# EAGLE schematic amyboard (EAGLE 6.1)
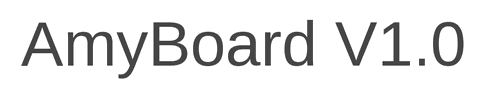
[diagram p0: schematic, sheet 1, part 1 of 3]
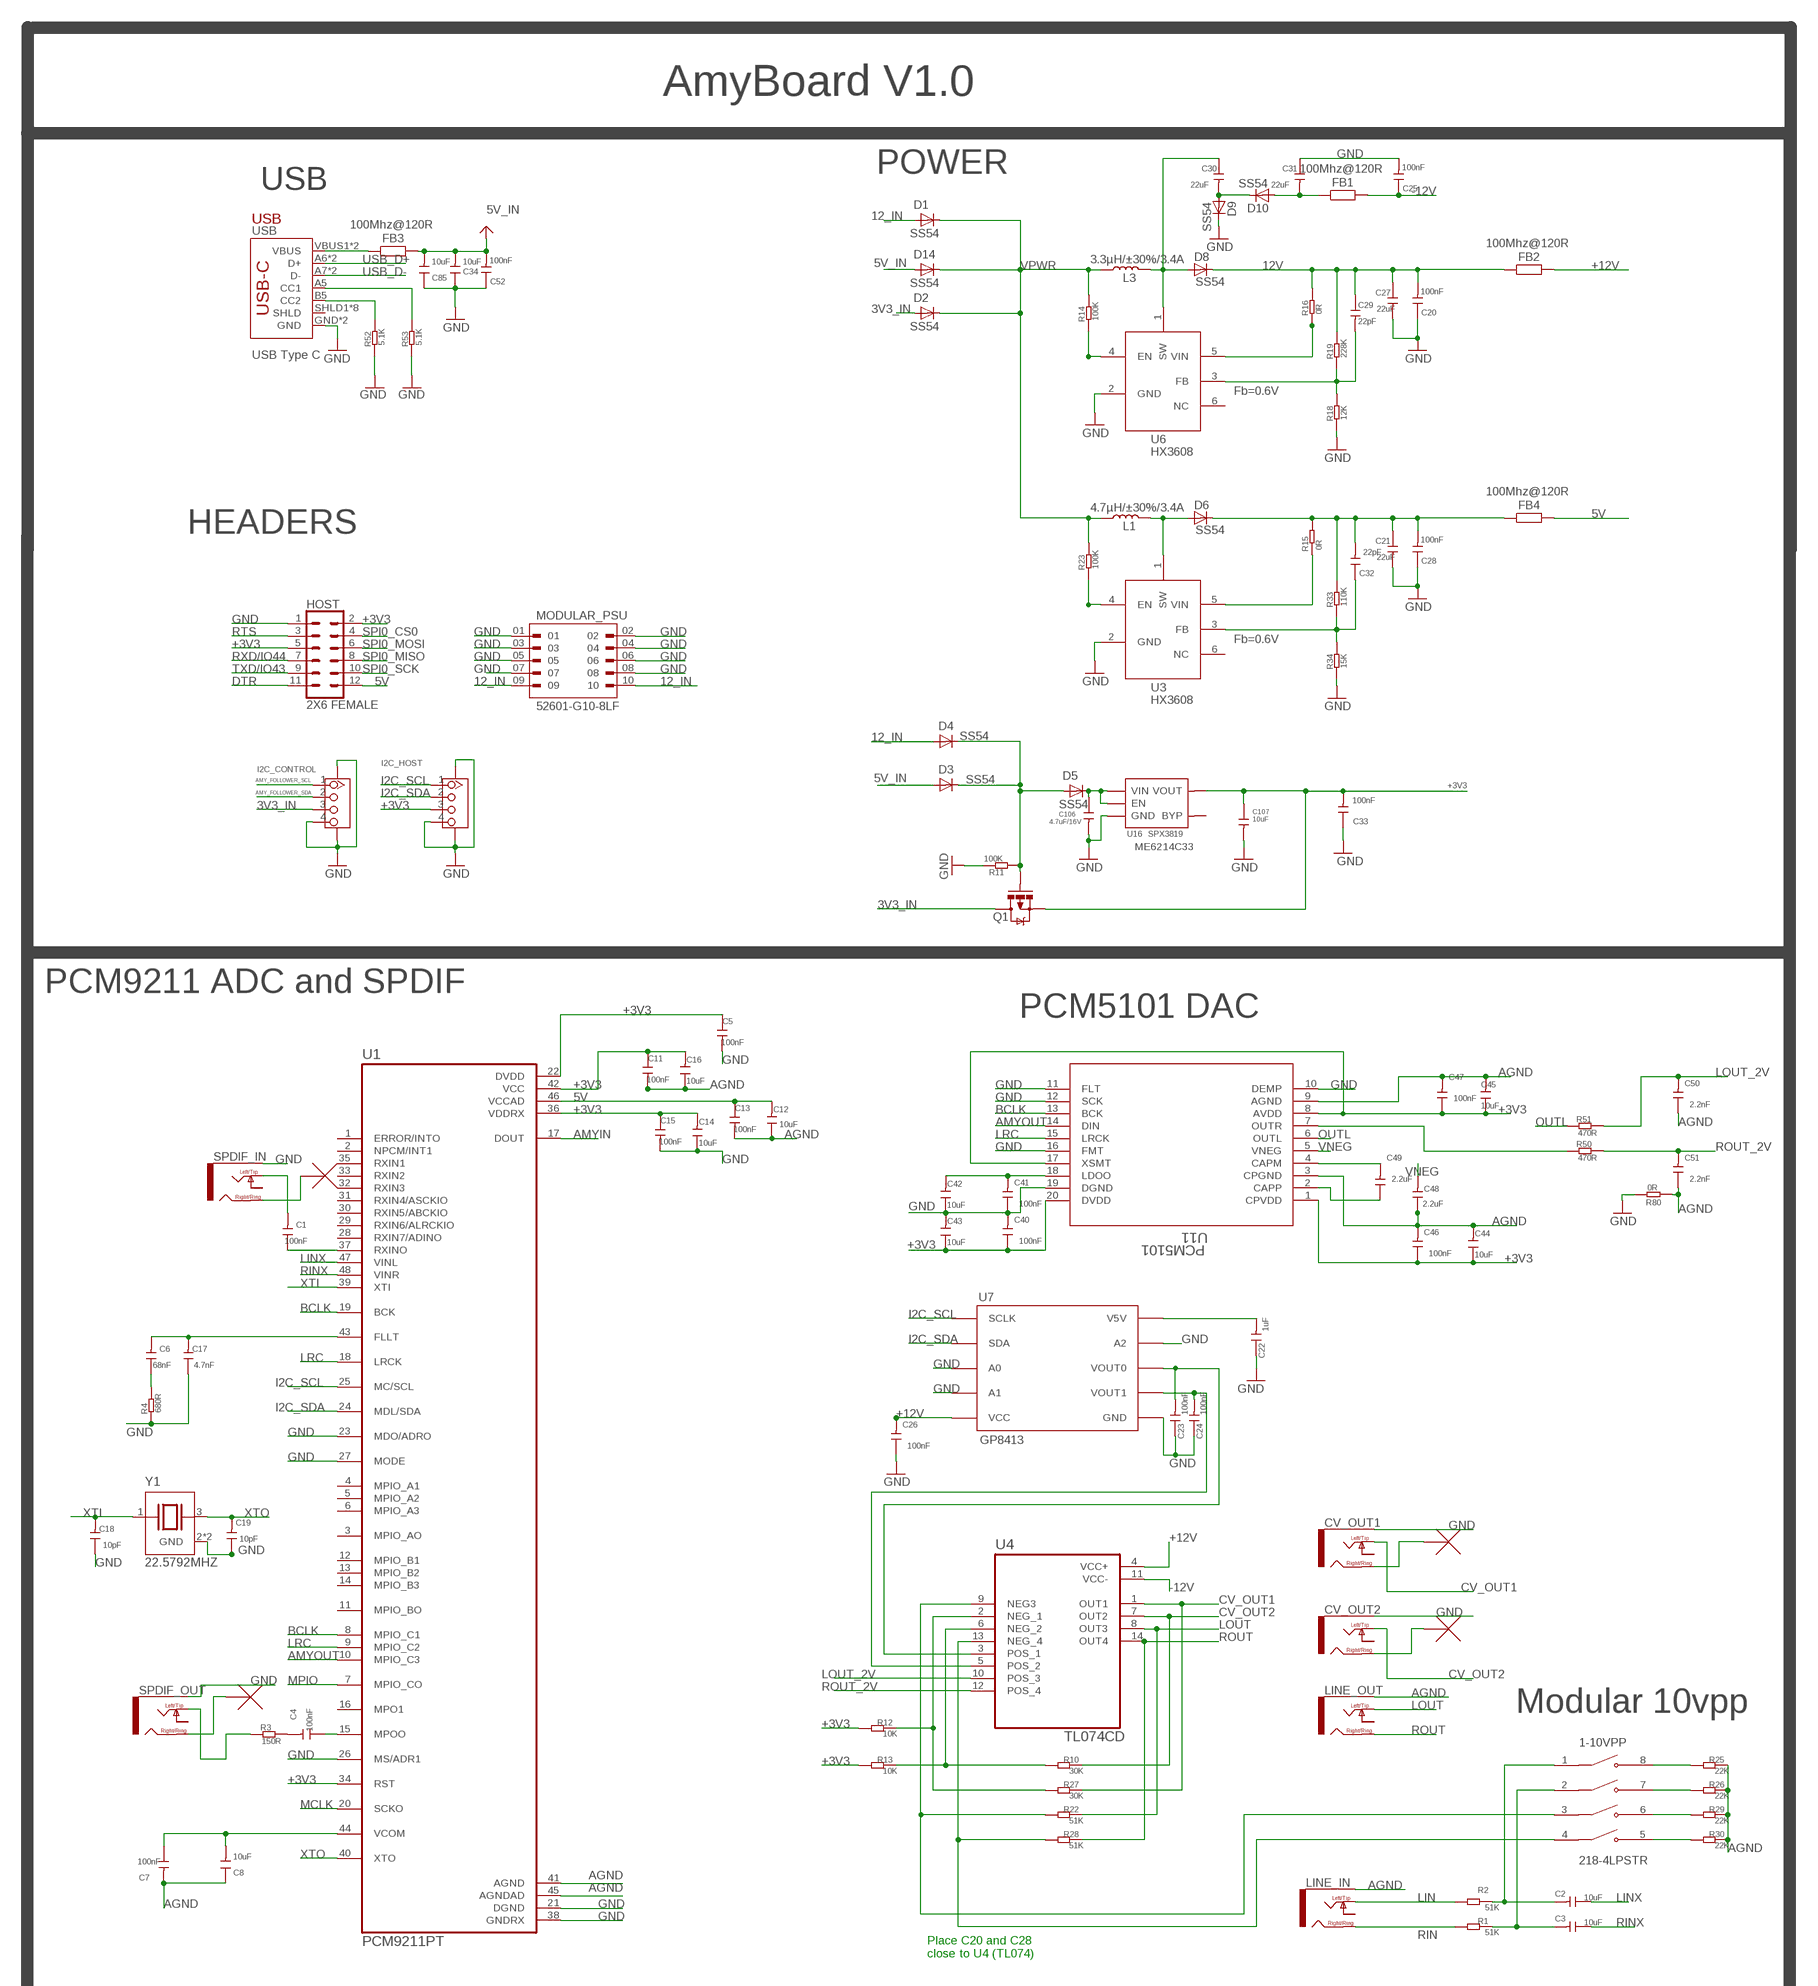
[diagram p1: schematic, sheet 1, part 2 of 3]
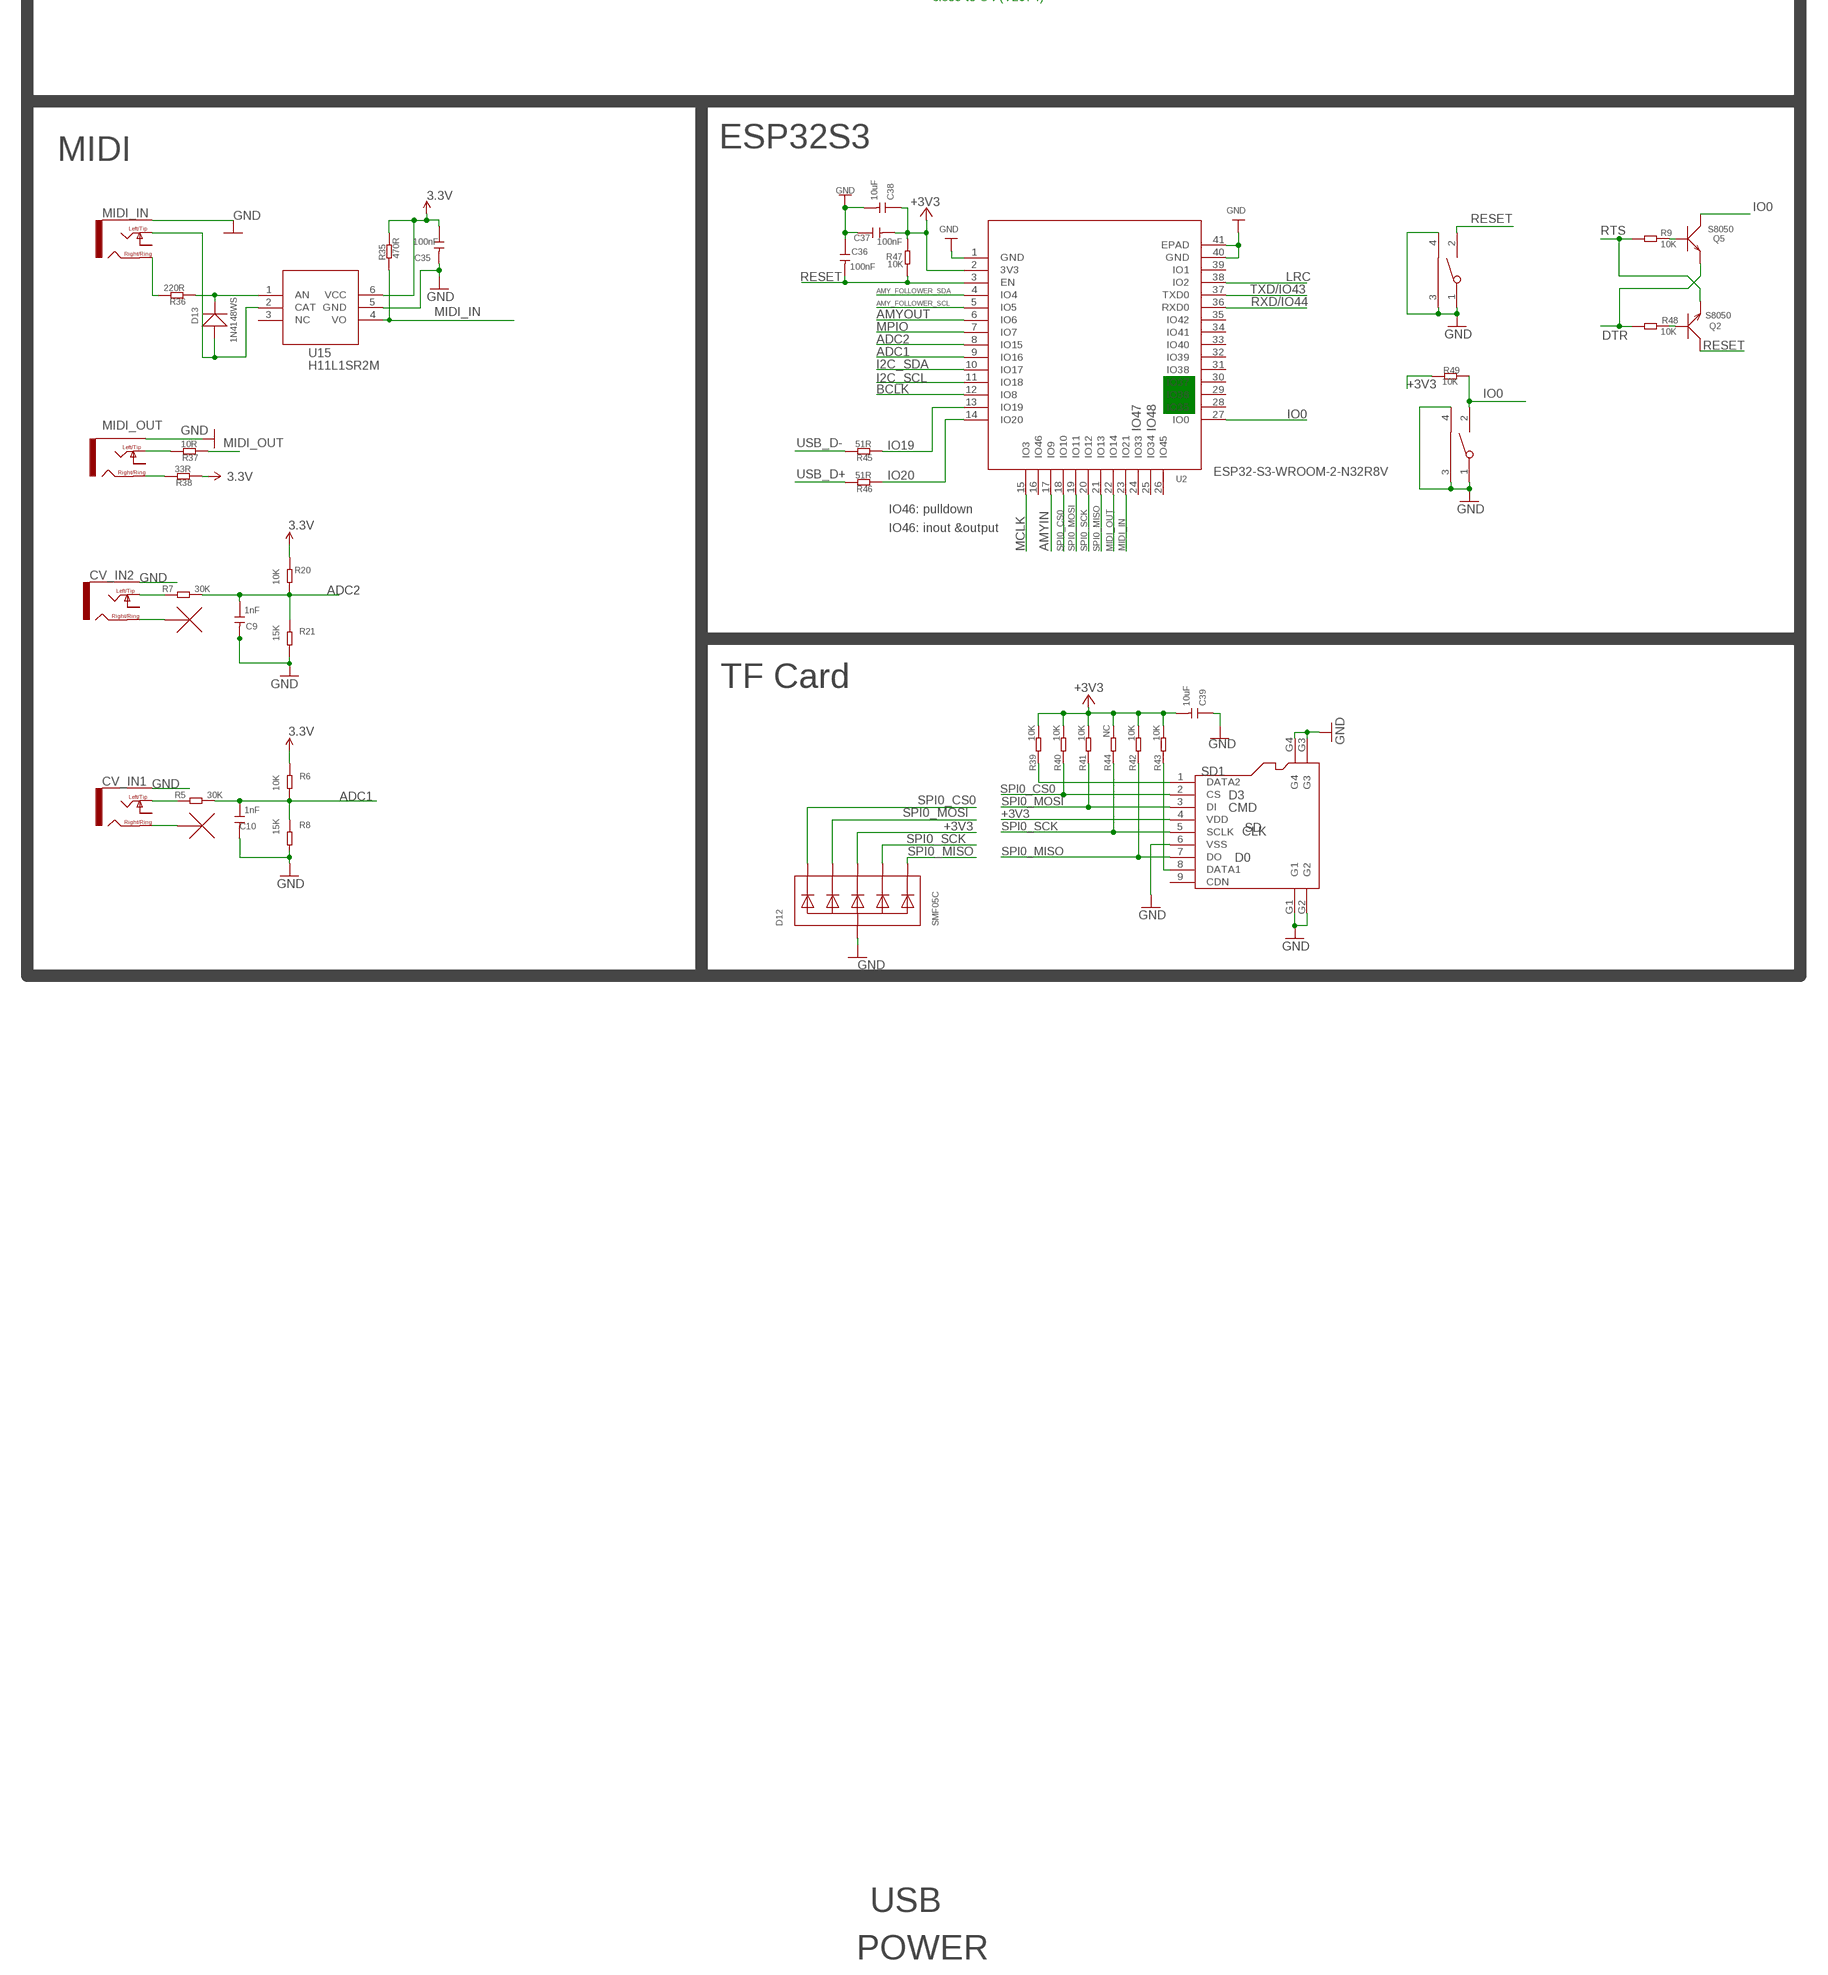
[diagram p2: schematic, sheet 1, part 3 of 3]

## Parts
1-10VPP  218-4LPSTR  [SW_218-4LPSTR]
BOOT  TS24CA  [2*4*3.5MM]
C1  100nF  DISCRETE_C-0402  [DISCRETE_C0402]
C2  10uF  DISCRETE_C-0603  [DISCRETE_C0603]
C3  10uF  DISCRETE_C-0603  [DISCRETE_C0603]
C4  100nF  DISCRETE_C-0402  [DISCRETE_C0402]
C5  100nF  DISCRETE_C-0402  [DISCRETE_C0402]
C6  68nF  DISCRETE_C-0402  [DISCRETE_C0402]
C7  100nF  DISCRETE_C-0402  [DISCRETE_C0402]
C8  10uF  DISCRETE_C-0603  [DISCRETE_C0603]
C9  1nF  DISCRETE_C-0402  [DISCRETE_C0402]
C10  1nF  DISCRETE_C-0402  [DISCRETE_C0402]
C11  100nF  DISCRETE_C-0402  [DISCRETE_C0402]
C12  10uF  DISCRETE_C-0603  [DISCRETE_C0603]
C13  100nF  DISCRETE_C-0402  [DISCRETE_C0402]
C14  10uF  DISCRETE_C-0603  [DISCRETE_C0603]
C15  100nF  DISCRETE_C-0402  [DISCRETE_C0402]
C16  10uF  DISCRETE_C-0603  [DISCRETE_C0603]
C17  4.7nF  DISCRETE_C-0402  [DISCRETE_C0402]
C18  10pF  DISCRETE_C-0402  [DISCRETE_C0402]
C19  10pF  DISCRETE_C-0402  [DISCRETE_C0402]
C20  100nF  DISCRETE_C-0402  [DISCRETE_C0402]
C21  22uF  CAP-0603  [C0603]
C22  1uF  DISCRETE_C-0402  [DISCRETE_C0402]
C23  100nF  DISCRETE_C-0402  [DISCRETE_C0402]
C24  100nF  DISCRETE_C-0402  [DISCRETE_C0402]
C25  100nF  DISCRETE_C-0402  [DISCRETE_C0402]
C26  100nF  DISCRETE_C-0402  [DISCRETE_C0402]
C27  22uF  CAP-0603  [C0603]
C28  100nF  DISCRETE_C-0402  [DISCRETE_C0402]
C29  22pF  CAP-0603  [C0603]
C30  22uF  CAP-0603  [C0603]
C31  22uF  CAP-0603  [C0603]
C32  22pF  DISCRETE_C-0402  [DISCRETE_C0402]
C33  100nF  DISCRETE_C-0402  [DISCRETE_C0402]
C34  10uF  DISCRETE_C-0603  [DISCRETE_C0603]
C35  100nF  DISCRETE_C-0402  [DISCRETE_C0402]
C36  100nF  DISCRETE_C-0402  [DISCRETE_C0402]
C37  100nF  DISCRETE_C-0402  [DISCRETE_C0402]
C38  10uF  DISCRETE_C-0603  [DISCRETE_C0603]
C39  10uF  DISCRETE_C-0603  [DISCRETE_C0603]
C40  100nF  DISCRETE_C-0402  [DISCRETE_C0402]
C41  100nF  DISCRETE_C-0402  [DISCRETE_C0402]
C42  10uF  DISCRETE_C-0603  [DISCRETE_C0603]
C43  10uF  DISCRETE_C-0603  [DISCRETE_C0603]
C44  10uF  DISCRETE_C-0603  [DISCRETE_C0603]
C45  10uF  DISCRETE_C-0603  [DISCRETE_C0603]
C46  100nF  DISCRETE_C-0402  [DISCRETE_C0402]
C47  100nF  DISCRETE_C-0402  [DISCRETE_C0402]
C48  2.2uF  DISCRETE_C-0402  [DISCRETE_C0402]
C49  2.2uF  DISCRETE_C-0402  [DISCRETE_C0402]
C50  2.2nF  DISCRETE_C-0402  [DISCRETE_C0402]
C51  2.2nF  DISCRETE_C-0402  [DISCRETE_C0402]
C52  100nF  DISCRETE_C-0402  [DISCRETE_C0402]
C85  10uF  DISCRETE_C-0603  [DISCRETE_C0603]
C106  4.7uF/16V  C-0603  [0603]
C107  10uF  C-0603  [0603]
CV_IN1  NV-PJ3410_STEREO  [NV-PJ3410_SOCKET]
CV_IN2  NV-PJ3410_STEREO  [NV-PJ3410_SOCKET]
CV_OUT1  NV-PJ3410_STEREO  [NV-PJ3410_SOCKET]
CV_OUT2  NV-PJ3410_STEREO  [NV-PJ3410_SOCKET]
D1  SS54  DIODE-DO-214AC  [DO-214AC]
D2  SS54  DIODE-DO-214AC  [DO-214AC]
D3  SS54  DIODE-DO-214AC  [DO-214AC]
D4  SS54  DIODE-DO-214AC  [DO-214AC]
D5  SS54  DIODE-DO-214AC  [DO-214AC]
D6  SS54  DIODE-DO-214AC  [DO-214AC]
D8  SS54  DIODE-DO-214AC  [DO-214AC]
D9  SS54  DIODE-DO-214AC  [DO-214AC]
D10  SS54  DIODE-DO-214AC  [DO-214AC]
D12  SMF05C  TVSARRAY_5LANE  [SOT363]
D13  1N4148WS  D'0805'  [SOD323]
D14  SS54  DIODE-DO-214AC  [DO-214AC]
FB1  100Mhz@120R  R-EU_R0805  [R0805]
FB2  100Mhz@120R  R-EU_R0805  [R0805]
FB3  100Mhz@120R  R-EU_R0805  [R0805]
FB4  100Mhz@120R  R-EU_R0805  [R0805]
HOST  2X6 FEMALE  CONN_06X2PTH_FEMALE  [2X6]
I2C_CONTROL  GROVE-CONNECTOR-SMD'90D'  [HW4-SMD-2.0-90D]
I2C_HOST  GROVE-CONNECTOR-SMD'90D'  [HW4-SMD-2.0-90D]
L1  4.7µH/±30%/3.4A  INDUCTOR-CR54-3.3UH  [CR54]
L3  3.3µH/±30%/3.4A  INDUCTOR-CR54-3.3UH  [CR54]
LINE_IN  NV-PJ3410_STEREO  [NV-PJ3410_SOCKET]
LINE_OUT  NV-PJ3410_STEREO  [NV-PJ3410_SOCKET]
MIDI_IN  NV-PJ3410_STEREO  [NV-PJ3410_SOCKET]
MIDI_OUT  NV-PJ3410_STEREO  [NV-PJ3410_SOCKET]
MODULAR_PSU  52601-G10-8LF  [AMPHENOL_52601-G10-8LF]
PCM5101  U11  PCM5101APW  [PW20_TEX]
Q1  AO3407  MOSFET-PCHANNEL  [SOT23-3]
Q2  S8050  TRANSISTOR-NPN-SOT23  [SOT23]
Q5  S8050  TRANSISTOR-NPN-SOT23  [SOT23]
R1  51K  DISCRETE_R-0402  [DISCRETE_R0402]
R2  51K  DISCRETE_R-0402  [DISCRETE_R0402]
R3  150R  DISCRETE_R-0402  [DISCRETE_R0402]
R4  680R  DISCRETE_R-0402  [DISCRETE_R0402]
R5  30K  DISCRETE_R-0402  [DISCRETE_R0402]
R6  10K  DISCRETE_R-0402  [DISCRETE_R0402]
R7  30K  DISCRETE_R-0402  [DISCRETE_R0402]
R8  15K  DISCRETE_R-0402  [DISCRETE_R0402]
R9  10K  DISCRETE_R-0402  [DISCRETE_R0402]
R10  30K  DISCRETE_R-0402  [DISCRETE_R0402]
R11  100K  DISCRETE_R-0402  [DISCRETE_R0402]
R12  10K  DISCRETE_R-0402  [DISCRETE_R0402]
R13  10K  DISCRETE_R-0402  [DISCRETE_R0402]
R14  100K  DISCRETE_R-0402  [DISCRETE_R0402]
R15  0R  DISCRETE_R-0402  [DISCRETE_R0402]
R16  0R  DISCRETE_R-0402  [DISCRETE_R0402]
R18  12K  DISCRETE_R-0402  [DISCRETE_R0402]
R19  228K  DISCRETE_R-0402  [DISCRETE_R0402]
R20  10K  DISCRETE_R-0402  [DISCRETE_R0402]
R21  15K  DISCRETE_R-0402  [DISCRETE_R0402]
R22  51K  DISCRETE_R-0402  [DISCRETE_R0402]
R23  100K  DISCRETE_R-0402  [DISCRETE_R0402]
R25  22K  DISCRETE_R-0402  [DISCRETE_R0402]
R26  22K  DISCRETE_R-0402  [DISCRETE_R0402]
R27  30K  DISCRETE_R-0402  [DISCRETE_R0402]
R28  51K  DISCRETE_R-0402  [DISCRETE_R0402]
R29  22K  DISCRETE_R-0402  [DISCRETE_R0402]
R30  22K  DISCRETE_R-0402  [DISCRETE_R0402]
R33  110K  DISCRETE_R-0402  [DISCRETE_R0402]
R34  15K  DISCRETE_R-0402  [DISCRETE_R0402]
R35  470R  DISCRETE_R-0402  [DISCRETE_R0402]
R36  220R  DISCRETE_R-0402  [DISCRETE_R0402]
R37  10R  DISCRETE_R-0402  [DISCRETE_R0402]
R38  33R  DISCRETE_R-0402  [DISCRETE_R0402]
R39  10K  DISCRETE_R-0402  [DISCRETE_R0402]
R40  10K  DISCRETE_R-0402  [DISCRETE_R0402]
R41  10K  DISCRETE_R-0402  [DISCRETE_R0402]
R42  10K  DISCRETE_R-0402  [DISCRETE_R0402]
R43  10K  DISCRETE_R-0402  [DISCRETE_R0402]
R44  NC  DISCRETE_R-0402  [DISCRETE_R0402]
R45  51R  DISCRETE_R-0402  [DISCRETE_R0402]
R46  51R  DISCRETE_R-0402  [DISCRETE_R0402]
R47  10K  DISCRETE_R-0402  [DISCRETE_R0402]
R48  10K  DISCRETE_R-0402  [DISCRETE_R0402]
R49  10K  DISCRETE_R-0402  [DISCRETE_R0402]
R50  470R  DISCRETE_R-0402  [DISCRETE_R0402]
R51  470R  DISCRETE_R-0402  [DISCRETE_R0402]
R52  5.1K  DISCRETE_R-0402  [DISCRETE_R0402]
R53  5.1K  DISCRETE_R-0402  [DISCRETE_R0402]
R80  0R  DISCRETE_R-0603  [DISCRETE_R0603]
RST  TS24CA  [2*4*3.5MM]
SD1  SD  HOLDER-MICROSD-9P  [9P-SMD-W/-RING]
SPDIF_IN  NV-PJ3410_STEREO  [NV-PJ3410_SOCKET]
SPDIF_OUT  NV-PJ3410_STEREO  [NV-PJ3410_SOCKET]
U1  PCM9211PT  [QFP50P900X900X160-48N]
U2  ESP32­S2­SOLO  [ESP32-­S2-­SOLO]
U3  HX3608  [SOT-23-6]
U4  TL074CD  [SOIC127P600X175-14N]
U6  HX3608  [SOT-23-6]
U7  GP8413  [SOIC-10]
U15  H11L1SR2M  [SOP-6-2.54MM]
U16  SPX3819  [SOT23-5]
U$1  NC_MARKER  (no package)
U$2  NC_MARKER  (no package)
U$3  NC_MARKER  (no package)
U$4  NC_MARKER  (no package)
U$5  NC_MARKER  (no package)
U$6  NC_MARKER  (no package)
USB  USB-C  USB_C5  [USB-C-16P-5]
Y1  22.5792MHZ  ABM10W-22.5792MHZ-8-K1Z-T3  [XTAL_ABM10W-22.5792MHZ-8-K1Z-T3]

## Nets
3.3V: C35.1 R6.2 R20.2 R35.1 R38.2 U15.6(VCC)
3V3_IN: D2.A I2C_CONTROL.3 Q1.3(D)
5V: C12.2 C13.1 FB4.2 HOST.12 U1.46(VCCAD)
5V_IN: C34.2 C52.2 C85.2 D3.A D14.A FB3.2 ; supply symbol labelled VBUS
12_IN: D1.A D4.A MODULAR_PSU.09 MODULAR_PSU.10
12V: C20.2 C21.1 C27.1 C28.2 C29.1 C32.2 D6.C D8.C FB2.1 FB4.1 R15.1 R16.1 R19.1 R33.1
+3V3: C5.1 C11.1 C14.2 C15.1 C16.2 C33.2 C37.2 C38.1 C39.2 C40.1 C43.1 C44.1 C45.1 C46.1 C47.1 C107.1 D12.4(C3) HOST.2 HOST.5 I2C_HOST.3 PCM5101.1(CPVDD) PCM5101.8(AVDD) PCM5101.17(XSMT) PCM5101.20(DVDD) Q1.2(S) R12.2 R13.2 R39.2 R40.2 R41.2 R42.2 R43.2 R44.2 R47.2 R49.2 SD1.4(VDD) U1.22(DVDD) U1.34(RST) U1.36(VDDRX) U1.42(VCC) U2.2(3V3) U16.5(VOUT)
+12V: C26.2 FB2.2 U4.4(VCC+) U7.5(VCC)
-12V: C25.1 FB1.2 U4.11(VCC-)
ADC1: C10.1 R5.1 R6.1 R8.2 U2.9(IO16)
ADC2: C9.1 R7.1 R20.1 R21.2 U2.8(IO15)
AGND: C7.2 C8.1 C11.2 C12.1 C13.2 C16.1 C44.2 C45.2 C46.2 C47.2 C48.1 C50.1 C51.1 LINE_IN.GND(EARTH) LINE_OUT.GND(EARTH) PCM5101.3(CPGND) PCM5101.9(AGND) R25.1 R26.1 R29.1 R30.1 R80.1 U1.41(AGND) U1.45(AGNDAD)
AMY_FOLLOWER_SCL: I2C_CONTROL.1 U2.5(IO5)
AMY_FOLLOWER_SDA: I2C_CONTROL.2 U2.4(IO4)
AMYIN: U1.17(DOUT) U2.17(IO9)
AMYOUT: PCM5101.14(DIN) U1.10(MPIO_C3) U2.6(IO6)
BCLK: PCM5101.13(BCK) U1.8(MPIO_C1) U1.19(BCK) U2.12(IO8)
CV_OUT1: CV_OUT1.LEFT/TIP(TIP) R27.1 U4.1(OUT1)
CV_OUT2: CV_OUT2.LEFT/TIP(TIP) R10.1 U4.7(OUT2)
DTR: HOST.11 Q5.2(E) R48.2
ENABLE: R14.2 U6.4(EN)
ENABLE1: R23.2 U3.4(EN)
GND: BOOT.1 BOOT.3 BOOT.4 C5.2 C9.2 C10.2 C14.1 C15.2 C17.1 C18.1 C19.1 C20.1 C21.2 C22.1 C23.1 C24.1 C25.2 C26.1 C27.2 C28.1 C31.1 C33.1 C34.1 C35.2 C36.1 C37.1 C38.2 C39.1 C40.2 C41.1 C42.1 C43.2 C52.1 C85.1 C106.2 C107.2 CV_IN1.GND(EARTH) CV_IN2.GND(EARTH) CV_OUT1.GND(EARTH) CV_OUT2.GND(EARTH) D9.C D12.2(A) HOST.1 I2C_CONTROL.4 I2C_CONTROL.SS1 I2C_CONTROL.SS2 I2C_HOST.4 I2C_HOST.SS1 I2C_HOST.SS2 MIDI_IN.GND(EARTH) MIDI_OUT.GND(EARTH) MODULAR_PSU.01 MODULAR_PSU.02 MODULAR_PSU.03 MODULAR_PSU.04 MODULAR_PSU.05 MODULAR_PSU.06 MODULAR_PSU.07 MODULAR_PSU.08 PCM5101.10(DEMP) PCM5101.11(FLT) PCM5101.12(SCK) PCM5101.16(FMT) PCM5101.19(DGND) R4.2 R8.1 R11.1 R18.2 R21.1 R34.2 R52.2 R53.2 R80.2 RST.1 RST.3 RST.4 SD1.6(VSS) SD1.G1 SD1.G2 SD1.G3 SD1.G4 SPDIF_IN.GND(EARTH) SPDIF_OUT.GND(EARTH) U1.21(DGND) U1.23(MDO/ADRO) U1.26(MS/ADR1) U1.27(MODE) U1.38(GNDRX) U2.1(GND) U2.40(GND) U2.41(EPAD) U3.2(GND) U6.2(GND) U7.3(A0) U7.4(A1) U7.6(GND) U7.9(A2) U15.5(GND) U16.2(GND) USB.GND USB.GND2(GND) Y1.2(GND) Y1.4(GND)
I2C_SCL: I2C_HOST.1 U1.25(MC/SCL) U2.11(IO18) U7.1(SCLK)
I2C_SDA: I2C_HOST.2 U1.24(MDL/SDA) U2.10(IO17) U7.2(SDA)
IO0: BOOT.2 Q5.3(C) R49.1 U2.27(IO0)
IO19: R45.2 U2.13(IO19)
IO20: R46.2 U2.14(IO20)
LIN: LINE_IN.LEFT/TIP(TIP) R2.2
LINX: C2.1 U1.47(VINL)
LOUT: LINE_OUT.LEFT/TIP(TIP) R22.1 U4.8(OUT3)
LOUT_2V: C50.2 R51.1 U4.10(POS_3)
LRC: PCM5101.15(LRCK) U1.9(MPIO_C2) U1.18(LRCK) U2.38(IO2)
MCLK: U1.20(SCKO) U2.15(IO3)
MIDI_IN: R35.2 U2.23(IO21) U15.4(VO)
MIDI_OUT: R37.2 U2.22(IO14)
MPIO: U1.7(MPIO_CO) U2.7(IO7)
N$1: C1.1 U1.37(RXINO)
N$2: C4.2 R3.1
N$3: C4.1 U1.15(MPOO)
N$4: 1-10VPP.1 C2.2 R2.1
N$5: 1-10VPP.2 C3.2 R1.1
N$6: C7.1 C8.2 U1.44(VCOM)
N$7: C6.2 C17.2 U1.43(FLLT)
N$8: C6.1 R4.1
N$9: SPDIF_OUT.RIGHT/RING(RING) U$1.P$1
N$10: SPDIF_IN.RIGHT/RING(RING) U$2.P$1
N$11: CV_OUT1.RIGHT/RING(RING) U$3.P$1
N$12: CV_OUT2.RIGHT/RING(RING) U$4.P$1
N$13: CV_IN2.LEFT/TIP(TIP) R7.2
N$14: CV_IN2.RIGHT/RING(RING) U$6.P$1
N$15: D6.A L1.P$2 U3.1(SW)
N$16: C31.2 D10.A FB1.1
N$17: CV_IN1.RIGHT/RING(RING) U$5.P$1
N$18: C23.2 U4.3(POS_1) U7.8(VOUT0)
N$19: CV_IN1.LEFT/TIP(TIP) R5.2
N$20: C24.2 U4.5(POS_2) U7.7(VOUT1)
N$21: C30.1 D8.A L3.P$2 U6.1(SW)
N$22: C22.2 U7.10(V5V)
N$23: D3.C D4.C D5.A Q1.1(G) R11.2
N$24: C106.1 D5.C U16.1(VIN) U16.3(EN)
N$25: C32.1 R33.2 R34.1 U3.3(FB)
N$26: C29.2 R18.1 R19.2 U6.3(FB)
N$28: R16.2 U6.5(VIN)
N$29: C30.2 D9.A D10.C
N$31: R10.2 R13.1 U4.6(NEG_2)
N$32: R15.2 U3.5(VIN)
N$33: R12.1 R27.2 U4.2(NEG_1)
N$34: Q2.1(B) R48.1
N$35: 1-10VPP.5 R30.2
N$36: 1-10VPP.6 R29.2
N$37: Q5.1(B) R9.1
N$38: R53.1 USB.A5(CC1)
N$39: R52.1 USB.B5(CC2)
N$40: 1-10VPP.8 R25.2
N$41: 1-10VPP.7 R26.2
N$42: FB3.1 USB.VBUS1(VBUS) USB.VBUS2(VBUS)
N$44: 1-10VPP.3 R22.2 U4.9(NEG3)
N$45: 1-10VPP.4 R28.2 U4.13(NEG_4)
N$48: C41.2 C42.2 PCM5101.18(LDOO)
N$50: PCM5101.7(OUTR) R50.2
N$51: C49.2 PCM5101.4(CAPM)
N$52: C49.1 PCM5101.2(CAPP)
N$55: D13.+ MIDI_IN.LEFT/TIP(TIP) U15.2(CAT)
N$56: MIDI_IN.RIGHT/RING(RING) R36.1
N$57: D13.- R36.2 U15.1(AN)
N$58: MIDI_OUT.LEFT/TIP(TIP) R37.1
N$59: MIDI_OUT.RIGHT/RING(RING) R38.1
N$75: R39.1 SD1.1(DATA2)
N$77: R43.1 SD1.8(DATA1)
OUTL: PCM5101.6(OUTL) R51.2
RESET: C36.2 Q2.3(C) R47.1 RST.2 U2.3(EN)
RIN: LINE_IN.RIGHT/RING(RING) R1.2
RINX: C3.1 U1.48(VINR)
ROUT: LINE_OUT.RIGHT/RING(RING) R28.1 U4.14(OUT4)
ROUT_2V: C51.2 R50.1 U4.12(POS_4)
RTS: HOST.3 Q2.2(E) R9.2
RXD/IO44: HOST.7 U2.36(RXD0)
SPDIFIN_SIGNAL: C1.2 SPDIF_IN.LEFT/TIP(TIP)
SPDIFOUT_SIGNAL: R3.2 SPDIF_OUT.LEFT/TIP(TIP)
SPI0_CS0: D12.1(C1) HOST.4 R40.1 SD1.2(CS) U2.18(IO10)
SPI0_MISO: D12.6(C5) HOST.8 R42.1 SD1.7(DO) U2.21(IO13)
SPI0_MOSI: D12.3(C2) HOST.6 R41.1 SD1.3(DI) U2.19(IO11)
SPI0_SCK: D12.5(C4) HOST.10 R44.1 SD1.5(SCLK) U2.20(IO12)
TXD/IO43: HOST.9 U2.37(TXD0)
USB_D+: R46.1 USB.A6(D+) USB.B6(D+)
USB_D-: R45.1 USB.A7(D-) USB.B7(D-)
VNEG: C48.2 PCM5101.5(VNEG)
VPWR: D1.C D2.C D14.C L1.P$1 L3.P$1 R14.1 R23.1
XTI: C18.2 U1.39(XTI) Y1.1
XTO: C19.2 U1.40(XTO) Y1.3
Unconnected: CV_IN1.SWITCH(TIP-NORM) CV_IN2.SWITCH(TIP-NORM) CV_OUT1.SWITCH(TIP-NORM) CV_OUT2.SWITCH(TIP-NORM) LINE_IN.SWITCH(TIP-NORM) LINE_OUT.SWITCH(TIP-NORM) MIDI_IN.SWITCH(TIP-NORM) MIDI_OUT.SWITCH(TIP-NORM) SD1.9(CDN) SPDIF_IN.SWITCH(TIP-NORM) SPDIF_OUT.SWITCH(TIP-NORM) U1.1(ERROR/INTO) U1.2(NPCM/INT1) U1.3(MPIO_AO) U1.4(MPIO_A1) U1.5(MPIO_A2) U1.6(MPIO_A3) U1.11(MPIO_BO) U1.12(MPIO_B1) U1.13(MPIO_B2) U1.14(MPIO_B3) U1.16(MPO1) U1.28(RXIN7/ADINO) U1.29(RXIN6/ALRCKIO) U1.30(RXIN5/ABCKIO) U1.31(RXIN4/ASCKIO) U1.32(RXIN3) U1.33(RXIN2) U1.35(RXIN1) U2.16(IO46) U2.24(IO33) U2.25(IO34) U2.26(IO45) U2.28(IO35) U2.29(IO36) U2.30(IO37) U2.31(IO38) U2.32(IO39) U2.33(IO40) U2.34(IO41) U2.35(IO42) U2.39(IO1) U3.6(NC) U6.6(NC) U15.3(NC) U16.4(BYP) USB.SHLD1(SHLD) USB.SHLD2(SHLD) USB.SHLD3(SHLD) USB.SHLD4(SHLD) USB.SHLD5(SHLD) USB.SHLD6(SHLD) USB.SHLD7(SHLD) USB.SHLD8(SHLD)

## Notes on the sheet
- AmyBoard V1.0
- AmyBoard V1.0
- POWER
- USB
- USB
- USB Type C
- Fb=0.6V
- HEADERS
- Fb=0.6V
- ME6214C33
- PCM9211 ADC and SPDIF
- PCM5101 DAC
- Modular 10vpp
- Place C20 and C28
  close to U4 (TL074)
- ESP32S3
- MIDI
- IO47 | IO48
- ESP32-S3-WROOM-2-N32R8V
- IO46: pulldown
- IO46: inout &output
- TF Card
- D3
- CMD
- CLK
- D0
- USB
- POWER

## Library data of the parts
1-10VPP = 218-4LPSTR:218-4LPSTR: Check availability <https://pricing.snapeda.com/parts/218-4LPSTR/CTS%20Electrocomponents/view-part?ref=eda>; AVAILABILITY: In Stock; CHECK_PRICES: https://www.snapeda.com/parts/218-4LPSTR/CTS+Components/view-part/?ref=eda; DESCRIPTION: Dip Switch SPST 4 Position Surface Mount Slide (Standard) Actuator 25mA 24VDC; MF: CTS Electrocomponents; MP: 218-4LPSTR; PACKAGE: None; PRICE: None; SNAPEDA_LINK: https://www.snapeda.com/parts/218-4LPSTR/CTS+Components/view-part/?ref=snap
BOOT RST = sale:TS24CA
C1-C20 C22-C26 C28 C32-C52 C85 = A9G:DISCRETE_C*: Ceramic Capacitors
C21 C27 C29-C31 = Discrete-new:CAP: Ceramic Capacitors
C106 C107 = Discrete:C*: Ceramic Capacitors
CV_IN1 CV_IN2 CV_OUT1 CV_OUT2 LINE_IN LINE_OUT MIDI_IN MIDI_OUT SPDIF_IN SPDIF_OUT = PJ3410_sockets:NV-PJ3410_STEREO: PJ3410 socket stereo with switch
D1-D6 D8-D10 D14 = diode:DIODE-: DIODE
D12 = microbuilder:TVSARRAY_5LANE: Voltage Transient Suppressor Array SOT363 SMF05C - 100W 5V: Digikey - SMF05CT1GOSCT-ND
D13 = Discrete:D*
FB1-FB4 = rcl:R-EU_: RESISTOR, European symbol
HOST = SparkFun-Connectors:CONN_06X2: Multi connection point. Often used as Generic Header-pin footprint for 0.1 inch spaced/style header connections On any of the 0.1 inch spaced packages, you can populate with these: Break Away Headers - Straight <https://www.sparkfun.com/products/116> (PRT-00116) Break Away Male Headers - Right Angle <https://www.sparkfun.com/products/553> (PRT-00553) Female Headers <https://www.sparkfun.com/products/115> (PRT-00115) Break Away Headers - Machine Pin <https://www.sparkfun.com/products/117> (PRT-00117) Break Away Female Headers - Swiss Machine Pin <https://www.sparkfun.com/products/743> (PRT-00743); PROD_ID: CONN-12423
I2C_CONTROL I2C_HOST = Connector-new:GROVE-CONNECTOR-SMD: 4P-SMD-2.0:320110030;4P-SMD-2.0-90D:320110032
L1 = SparkFun-Coils:INDUCTOR: Inductors Resist changes in electrical current. Basically a coil of wire. SparkFun Products: SparkFun Load Cell Amplifier - HX711 <https://www.sparkfun.com/products/13879> IOIO-OTG - V2.2 <https://www.sparkfun.com/products/13613>; PROD_ID: NDUC-11157; VALUE: 3.3µH/±30%/3.4A
L3 = SparkFun-Coils:INDUCTOR: Inductors Resist changes in electrical current. Basically a coil of wire. SparkFun Products: SparkFun Load Cell Amplifier - HX711 <https://www.sparkfun.com/products/13879> IOIO-OTG - V2.2 <https://www.sparkfun.com/products/13613>; PROD_ID: NDUC-11157
MODULAR_PSU = 52601-G10-8LF:52601-G10-8LF: Check availability <https://pricing.snapeda.com/parts/52601-G10-8LF/Amphenol%20ICC/view-part?ref=eda>; AVAILABILITY: In Stock; CHECK_PRICES: https://www.snapeda.com/parts/52601-G10-8LF/Amphenol+FCI/view-part/?ref=eda; DESCRIPTION: Conn; Rect; Header; SMT; Shroud; 2.54 mm; 2-Row; 10 Pos; Gold (30) Plate;Quickie | Amphenol FCI (Amphenol CS) 52601-G10-8LF; MF: Amphenol ICC; MP: 52601-G10-8LF; PACKAGE: None; PRICE: None; SNAPEDA_LINK: https://www.snapeda.com/parts/52601-G10-8LF/Amphenol+FCI/view-part/?ref=snap
PCM5101 = pcm5101apw:PCM5101APW; COPYRIGHT: Copyright (C) 2022 Ultra Librarian. All rights reserved.; DIGI-KEY_PART_NUMBER_1: PCM5101APW-ND; MANUFACTURER_PART_NUMBER: PCM5101APW; MFR_NAME: Texas Instruments
Q1 = User-Submitted:MOSFET-PCHANNEL: Generic PMOSFET IRLML2244 - TRANS-11153 (SOT-23 -20V -4.3A) (1.Gate 2.Source 3.Drain) FQP27P06 - COM-10349 <http://www.sparkfun.com/products/10349> (TO-220 -60V -27A) (1.Gate 2.Source 3.Drain); PROD_ID: TRANS-08285
Q2 Q5 = Discrete:TRANSISTOR-NPN*: NPN audion
R1-R16 R18-R23 R25-R30 R33-R53 R80 = A9G:DISCRETE_R*
SD1 = Connector:HOLDER-MICROSD-9P
U1 = PCM9211PT:PCM9211PT: Check availability <https://pricing.snapeda.com/parts/PCM9211PT/Texas%20Instruments/view-part?ref=eda>; AVAILABILITY: In Stock; CHECK_PRICES: https://www.snapeda.com/parts/PCM9211PT/Texas+Instruments/view-part/?ref=eda; DESCRIPTION: 216kHz Digital Audio Interface Transceiver (DIX) with Stereo ADC and Routing; MF: Texas Instruments; MP: PCM9211PT; PACKAGE: LQFP-48 Texas Instruments; PRICE: None; SNAPEDA_LINK: https://www.snapeda.com/parts/PCM9211PT/Texas+Instruments/view-part/?ref=snap
U2 = self:ESP32­S2­SOLO
U3 U6 = self:HX3608
U4 = TL074CD:TL074CD: Check availability <https://pricing.snapeda.com/parts/TL074CD/Texas%20Instruments/view-part?ref=eda>; AVAILABILITY: In Stock; CHECK_PRICES: https://www.snapeda.com/parts/TL074CD/Texas+Instruments/view-part/?ref=eda; DESCRIPTION: Quad, 30-V, 3-MHz, high slew rate (13-V/µs), In to V+, JFET-input op amp; MF: Texas Instruments; MP: TL074CD; PACKAGE: SOIC-14 Texas Instruments; PRICE: None; SNAPEDA_LINK: https://www.snapeda.com/parts/TL074CD/Texas+Instruments/view-part/?ref=snap
U7 = FL5160MX:GP8413: https://www.mouser.com/ProductDetail/ON-Semiconductor-Fairchild/FL5160MX?qs=%2fha2pyFaduhZ4yOtT1cFvr2BtPh63RpxkXQRTY8DgC4%3d Check availability <https://pricing.snapeda.com/parts/FL5160MX/onsemi/view-part?ref=eda>; AVAILABILITY: In Stock; CHECK_PRICES: https://www.snapeda.com/parts/FL5160MX/Onsemi/view-part/?ref=eda; DESCRIPTION: Optocoupler Drive 1-CH 5.5V 10-Pin SOIC N T/R; MF: onsemi; MP: FL5160MX; PACKAGE: None; PRICE: None; SNAPEDA_LINK: https://www.snapeda.com/parts/FL5160MX/Onsemi/view-part/?ref=snap
U15 = sale:H11L1SR2M
U16 = IC:SPX3819
U$1-U$6 = NC_MARKER:NC_MARKER
USB = USBC:USB_C: USB Type C 16Pin Connector Super Speed pins not available on the 16-pin purely SMD connector so this part is best for USB 2.0 implementations. D1 and D2 are tied together enabling D+/- no matter which way the cable is plugged into the connector. The two channel configuration pins (CC1/2) are exposed. These are normally connected to ground via 5.1k resistors but can be reconfigured for high current/high power applications.
Y1 = ABM10W-22.5792MHZ-8-K1Z-T3:ABM10W-22.5792MHZ-8-K1Z-T3: Check availability <https://pricing.snapeda.com/parts/ABM10W-22.5792MHZ-8-K1Z-T3/Abracon/view-part?ref=eda>; AVAILABILITY: In Stock; CHECK_PRICES: https://www.snapeda.com/parts/ABM10W-22.5792MHZ-8-K1Z-T3/Abracon/view-part/?ref=eda; DESCRIPTION: IoT OPTIMIZED LOW PROFILE QUARTZ CRYSTAL; MF: Abracon; MP: ABM10W-22.5792MHZ-8-K1Z-T3; PACKAGE: SMD-4 Abracon; PRICE: None; SNAPEDA_LINK: https://www.snapeda.com/parts/ABM10W-22.5792MHZ-8-K1Z-T3/Abracon/view-part/?ref=snap

## Net classes
0 default: width 0.152 mm, drill 0.305 mm, clearance 0.152 mm